# EAGLE design bottom (EAGLE 9.5.2)
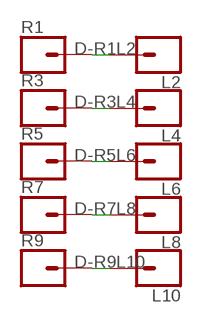
[diagram p0: schematic, sheet 1]

## Parts
L2  CONN_01  [1X01]
L4  CONN_01  [1X01]
L6  CONN_01  [1X01]
L8  CONN_01  [1X01]
L10  CONN_01  [1X01]
R1  CONN_01  [1X01]
R3  CONN_01  [1X01]
R5  CONN_01  [1X01]
R7  CONN_01  [1X01]
R9  CONN_01  [1X01]

## Nets
D-R1L2 [DATA]: L2.1 R1.1
D-R3L4 [DATA]: L4.1 R3.1
D-R5L6 [DATA]: L6.1 R5.1
D-R7L8 [DATA]: L8.1 R7.1
D-R9L10 [DATA]: L10.1 R9.1

## Library data of the parts
L2 L4 L6 L8 L10 R1 R3 R5 R7 R9 = SparkFun-Connectors:CONN_01: Single connection point. Often used as Generic Header-pin footprint for 0.1 inch spaced/style header connections On any of the 0.1 inch spaced packages, you can populate with these: Break Away Headers - Straight <https://www.sparkfun.com/products/116> (PRT-00116) Break Away Male Headers - Right Angle <https://www.sparkfun.com/products/553> (PRT-00553) Female Headers <https://www.sparkfun.com/products/115> (PRT-00115) Break Away Headers - Machine Pin <https://www.sparkfun.com/products/117> (PRT-00117) Break Away Female Headers - Swiss Machine Pin <https://www.sparkfun.com/products/743> (PRT-00743) This device is also useful as a general connection point to wire up your design to another part of your project. Our various solder wires solder well into these plated through hole pads. Hook-Up Wire - Assortment (Stranded, 22 AWG) <https://www.sparkfun.com/products/11375> (PRT-11375) Hook-Up Wire - Assortment (Solid Core, 22 AWG) <https://www.sparkfun.com/products/11367> (PRT-11367) View the entire wire category on our website here <https://www.sparkfun.com/categories/141> Special notes: SMTSO-256-ET is a "flush mount" nut for a 4-40 screw. We mostly use this on specialty testbeds; it is a nice way to connect hardware to your PCB at an adjustable hieght. Also note, the SNAP packages are for using a snappable style connector. We sell a baggie of snaps and they are also used on two LilyPad designs: Snap Assortment - 30 pack (male and female) <https://www.sparkfun.com/products/11347> (DEV-11347) LilyPad Arduino SimpleSnap <https://www.sparkfun.com/products/10941> (DEV-10941) LilyPad SimpleSnap Protoboard <https://www.sparkfun.com/products/10940> (DEV-10940)

## Net classes
1 DATA: width 1 mm, clearance 0.5 mm

## Board
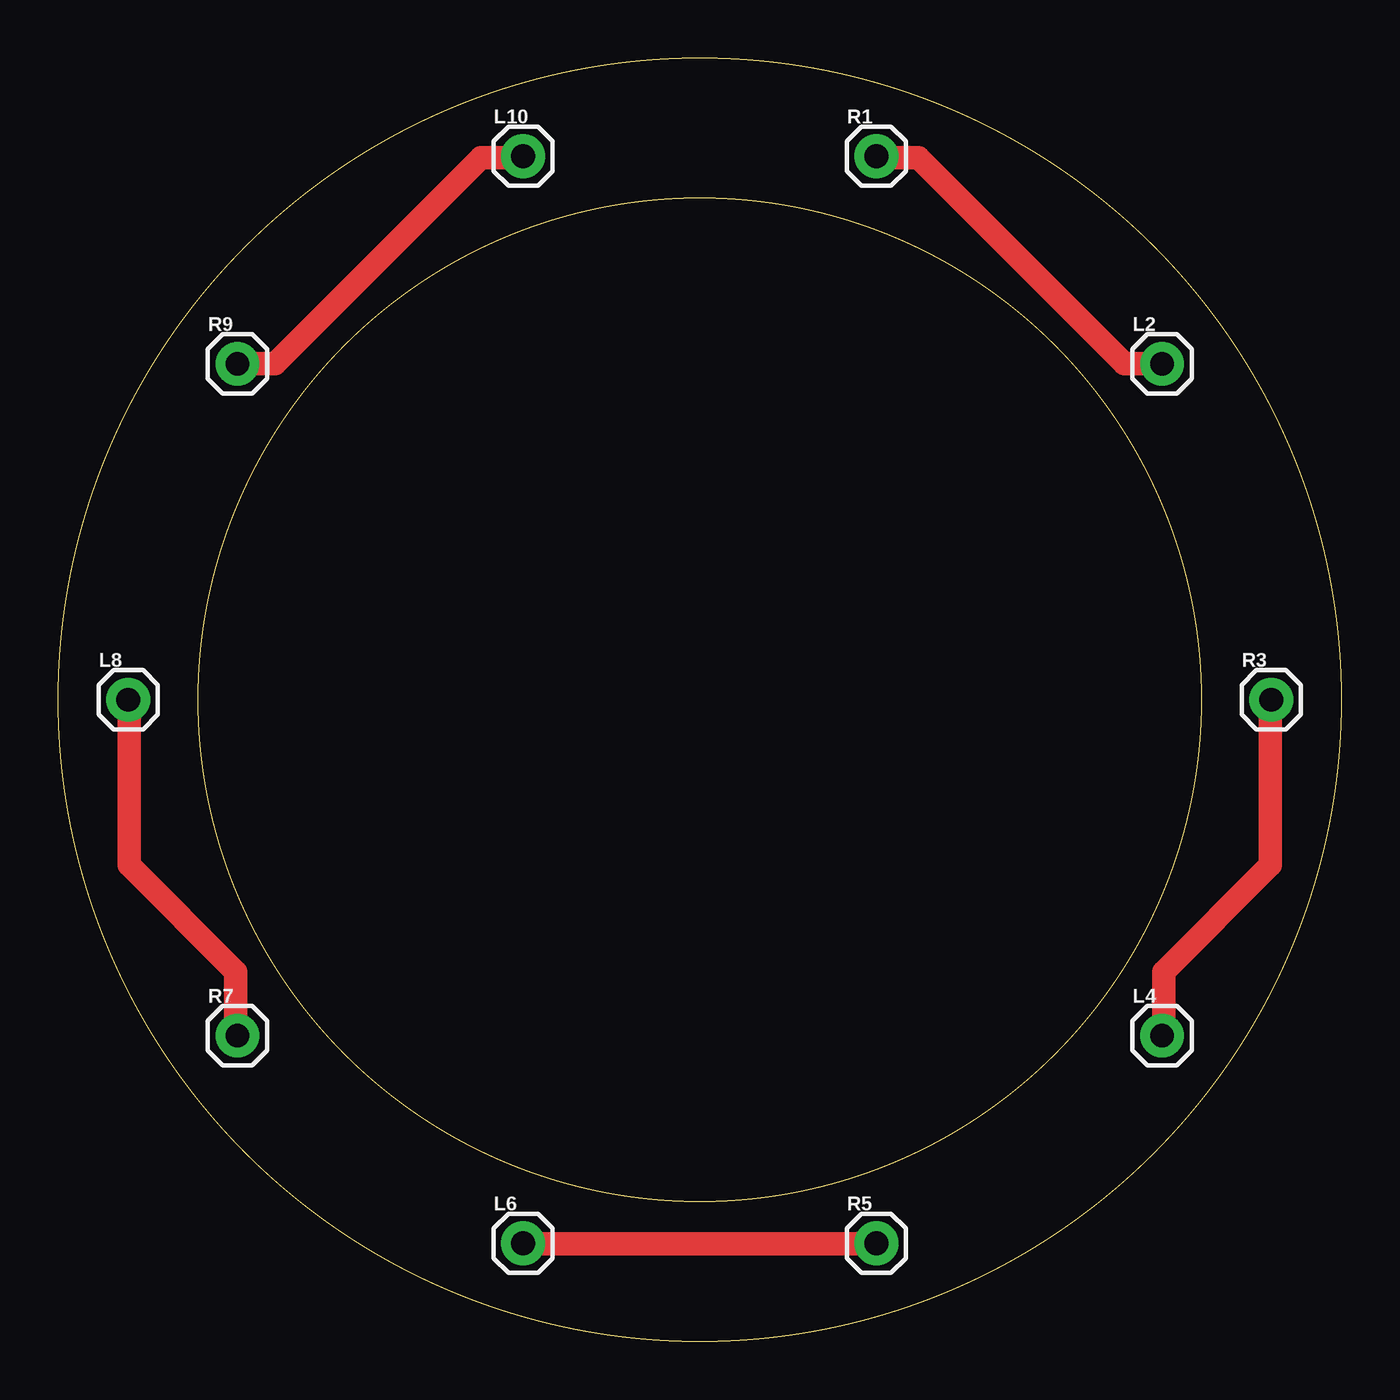
[diagram p1: board, top side]

Size 55 x 55 mm. Coordinates in mm from the lower left corner, seen from the top.
Outline: circle at 27.5,27.5 radius 27.5
Outline: circle at 27.5,27.5 radius 21.5
Copper layers (1*16): Top 0.035mm / dielectric 1.5mm / Bottom 0.035mm
Design rules "default": minimum track width 6mil, minimum drill 0.35mm, track to track 6mil, track to pad 6mil, pad to pad 6mil, via to via 6mil, smd to smd 6mil, copper to edge 40mil, drill to drill 6mil, minimum pad ring 10mil, minimum via ring 8mil, stop-mask expansion 4mil, vias tented up to drill 0mil, thermal gap 10mil

### Footprints (pad centres in the part's own frame; a part is rotated, then mirrored left to right if it is on the bottom)
1X01 = drill 1.016 pad 1.88: 1 0,0

### Placement (x,y rotation side)
L2  47.32,41.9 0 top
L4  47.32,13.1 0 top
L6  19.93,4.2 0 top
L8  3,27.5 0 top
L10  19.93,50.8 0 top
R1  35.07,50.8 0 top
R3  52,27.5 0 top
R5  35.07,4.2 0 top
R7  7.68,13.1 0 top
R9  7.68,41.9 0 top

### Tracks (layer width: path | path; a pad name or v marks a point on that pad's centre or on a via)
D-R1L2
  Top 1: L2.1 45.71,41.9 36.87,50.74 35.12,50.74 R1.1
D-R3L4
  Top 1: L4.1 47.39,13.17 47.39,15.84 51.96,20.41 51.96,27.5 R3.1
D-R5L6
  Top 1: L6.1 19.96,4.18 35.04,4.18 R5.1
D-R7L8
  Top 1: R7.1 7.61,13.17 7.61,15.84 3.04,20.41 3.04,27.5 L8.1
D-R9L10
  Top 1: R9.1 9.29,41.9 18.13,50.74 19.88,50.74 L10.1